# EAGLE design lights.v2 (EAGLE 5.11)
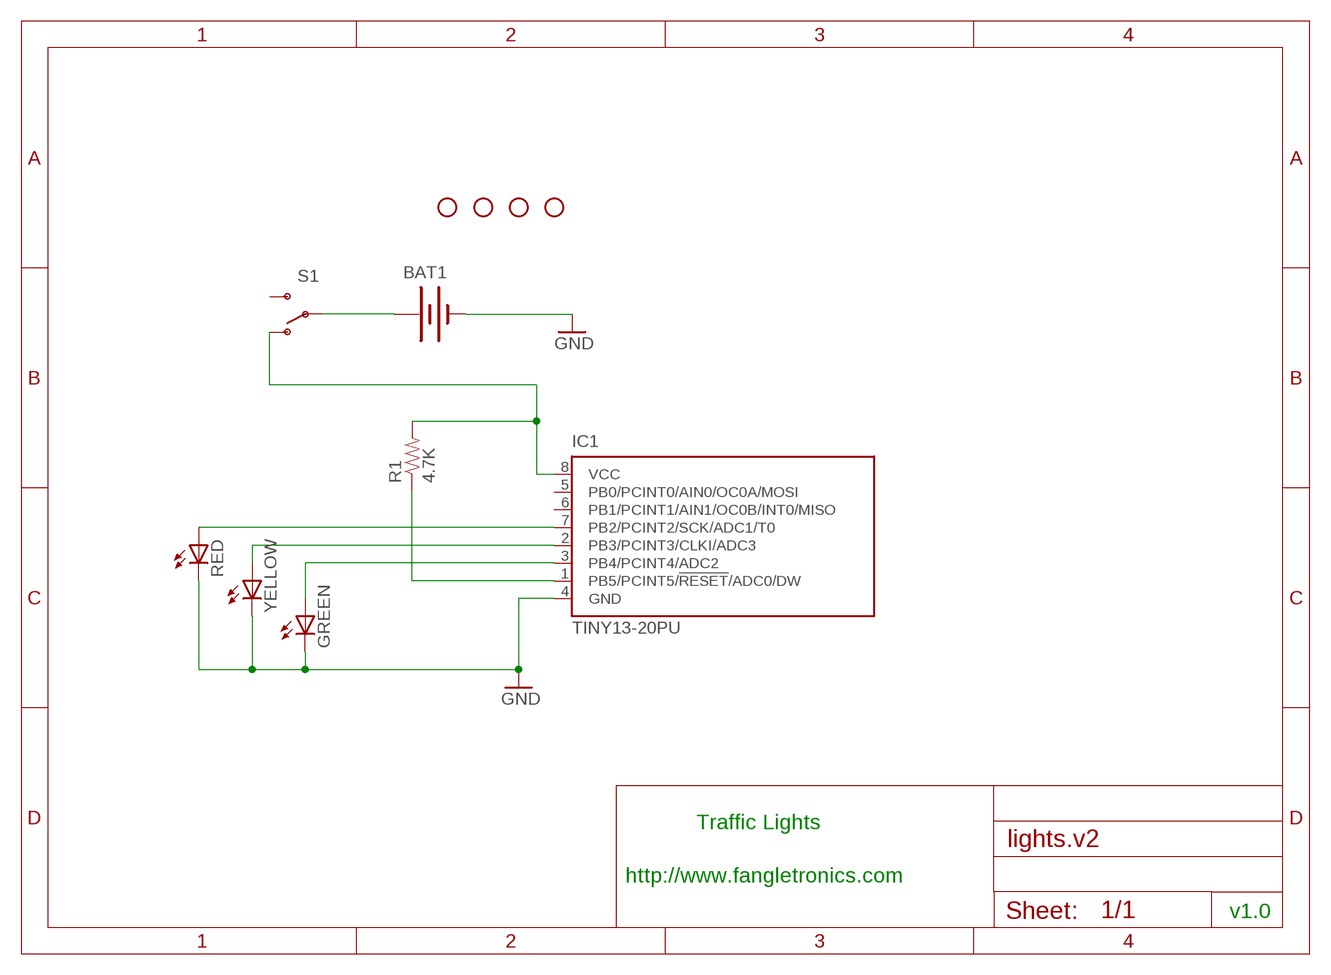
[diagram p0: schematic, sheet 1]

## Parts
BAT1  BATTERY20PTH  [BATTCOM_20MM_PTH]
GREEN  LED5MM  [LED5MM]
IC1  TINY13-20PU  [DIL08]
JP1  STAND-OFF  [STAND-OFF]
JP2  STAND-OFF  [STAND-OFF]
JP3  STAND-OFF  [STAND-OFF]
JP4  STAND-OFF  [STAND-OFF]
R1  4.7K  RESISTORPTH1  [AXIAL-0.3]
RED  LED5MM  [LED5MM]
S1  SWITCH-SPSTPTH  [SWITCH-SPDT]
YELLOW  LED5MM  [LED5MM]

## Nets
GND: BAT1.2(-) GREEN.K(C) IC1.4(GND) RED.K(C) YELLOW.K(C)
N$1: IC1.7(PB2/PCINT2/SCK/ADC1/T0) RED.A
N$2: IC1.2(PB3/PCINT3/CLKI/ADC3) YELLOW.A
N$3: GREEN.A IC1.3(PB4/PCINT4/ADC2)
N$4: IC1.1(PB5/PCINT5/!RESET!/ADC0/DW) R1.P$1
N$5: IC1.8(VCC) R1.P$2 S1.1(O)
N$6: BAT1.1(+) S1.2(P)
Unconnected: IC1.5(PB0/PCINT0/AIN0/OC0A/MOSI) IC1.6(PB1/PCINT1/AIN1/OC0B/INT0/MISO) S1.3(S)

## Notes on the sheet
- Traffic Lights
- http://www.fangletronics.com
- v1.0

## Library data of the parts
BAT1 = SparkFun:BATTERY: Battery Holders Various common sizes : AA, AAA, 20mm coin cell and 12mm coin cell.
GREEN RED YELLOW = SparkFun:LED: LEDs Standard schematic elements and footprints for 5mm, 3mm, 1206, and 0603 sized LEDs. 5mm - Spark Fun Electronics SKU : COM-00529 (and others)
IC1 = atmel:TINY13: 8-bit AVR Microcontroller with 1K Bytes In-System Programmable Flash Source: http://www.atmel.com/dyn/resources/prod_documents/2535S.pdf; MPN: ATTINY13-20PU; OC_FARNELL: 9171550; OC_NEWARK: 96K6521
JP1-JP4 = SparkFun:STAND-OFF: Stand Off This is the mechanical footprint for a #4 phillips button head screw. Use the keepout ring to avoid running the screw head into surrounding components. SKU : PRT-00447
R1 = Blank_Shield:RESISTOR: Resistor Basic schematic elements and footprints for 0603, 1206, and PTH 1/10th watt (small) resistors.
S1 = SparkFun:SWITCH-SPST: SPST Switch Simple slide switch. Spark Fun Electronics SKU : COM-00102

## Net classes
0 default: width 0.305 mm

## Board
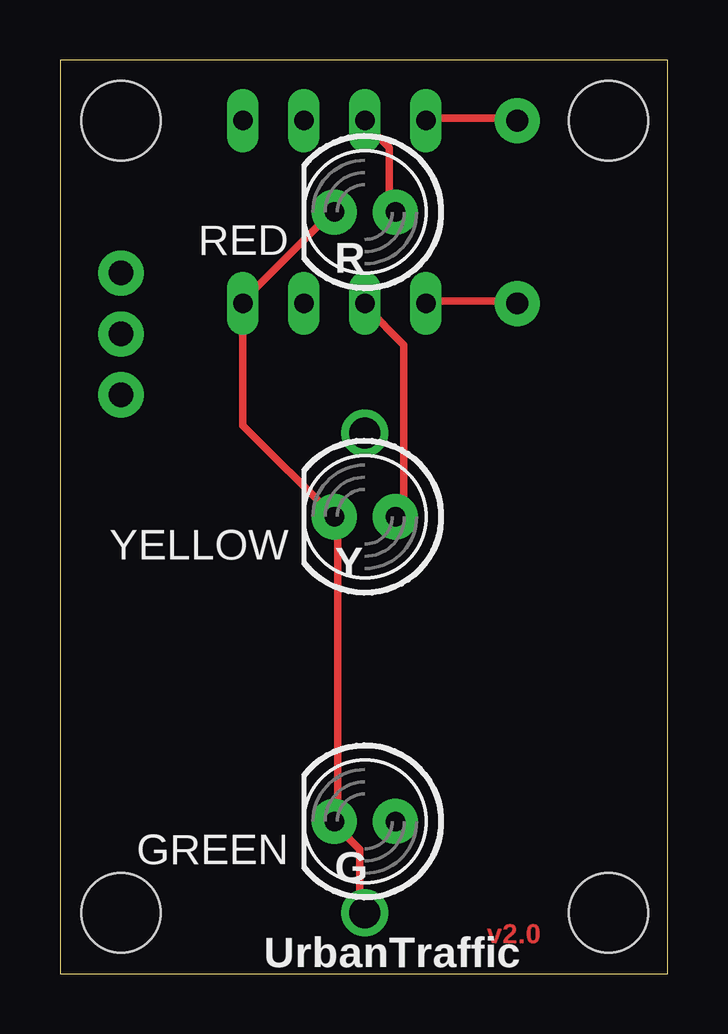
[diagram p1: board, top side]
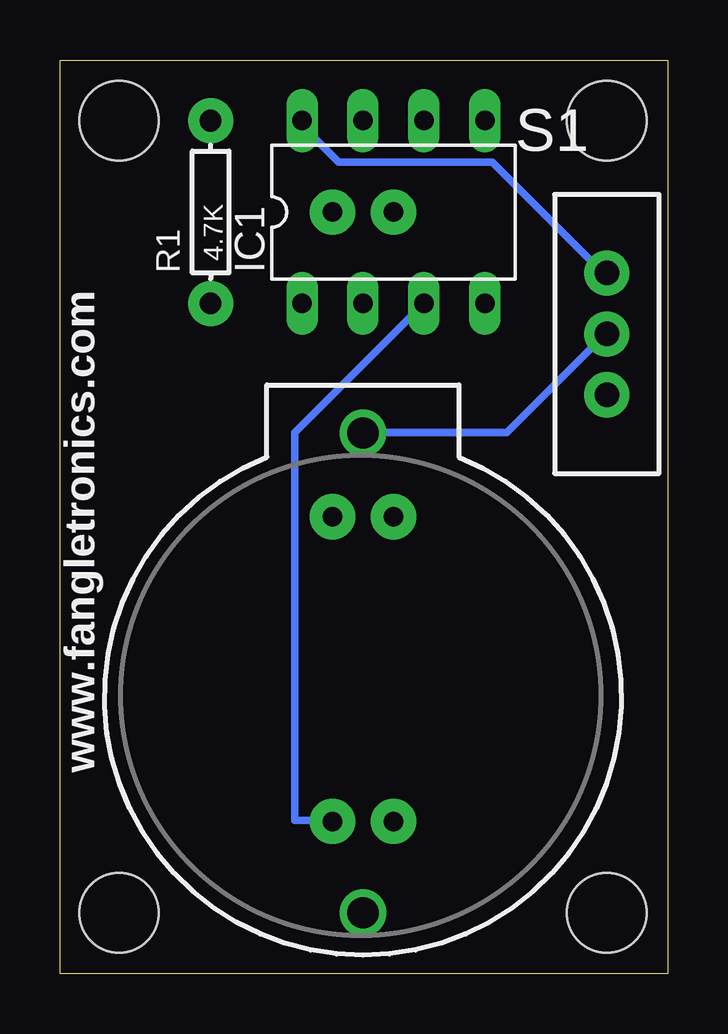
[diagram p2: board, bottom side, seen from below]

Size 25.32 x 38.09 mm. Coordinates in mm from the lower left corner, seen from the top.
Outline: 0,0 25.32,0 25.32,38.09 0,38.09 0,0
Copper layers (1*16): Top 0.035mm / dielectric 1.5mm / Bottom 0.035mm
Design rules "default": minimum track width 10mil, minimum drill 24mil, track to track 8mil, track to pad 8mil, pad to pad 8mil, via to via 8mil, smd to smd 8mil, copper to edge 40mil, drill to drill 8mil, minimum pad ring 10mil, minimum via ring 8mil, stop-mask expansion 4mil, vias tented up to drill 0mil, thermal gap 10mil

### Footprints (pad centres in the part's own frame; a part is rotated, then mirrored left to right if it is on the bottom)
BATTCOM_20MM_PTH = drill 1.3 round: 1 20,0; 2 0,0
LED5MM = drill 0.813 pad 1.88 round: A -1.27,0; K 1.27,0
DIL08 = drill 0.813 long: 1 -3.81,-3.81; 2 -1.27,-3.81; 3 1.27,-3.81; 4 3.81,-3.81; 5 3.81,3.81; 6 1.27,3.81; 7 -1.27,3.81; 8 -3.81,3.81
STAND-OFF = hole 3.302: 0,0
AXIAL-0.3 = drill 0.9 pad 1.88 round: P$1 -3.81,0; P$2 3.81,0
SWITCH-SPDT = drill 1.016 pad 1.88 round: 1 0,2.54; 2 0,0; 3 0,-2.54

### Placement (x,y rotation side)
BAT1  12.7,2.54 90 bottom
GREEN  12.7,6.35 180 top
IC1  11.43,31.75 0 bottom
JP1  22.86,2.54 0 top
JP2  2.54,2.54 0 top
JP3  2.54,35.56 0 top
JP4  22.86,35.56 0 top
R1  19.05,31.75 90 bottom
RED  12.7,31.75 180 top
S1  2.54,26.67 0 bottom
YELLOW  12.7,19.05 180 top

### Tracks (layer width: path | path; a pad name or v marks a point on that pad's centre or on a via)
GND
  Top 0.305: BAT1.2 12.5,2.74 12.5,5.18 11.58,6.1 GREEN.K 11.58,6.4 11.58,18.9 YELLOW.K 7.62,22.86 IC1.4 7.62,28.04 11.28,31.7 RED.K
N$1
  Top 0.305: IC1.7 12.8,35.36 13.72,34.44 13.72,32 RED.A
N$2
  Top 0.305: IC1.2 12.8,27.74 14.33,26.21 14.33,19.51 14.02,19.2 YELLOW.A
N$3
  Bottom 0.305: IC1.3 15.54,22.55 15.54,6.4 14.02,6.4 GREEN.A
N$4
  Top 0.305: IC1.1 15.24,28.04 18.9,28.04 R1.P$1
N$5
  Top 0.305: IC1.8 15.24,35.66 18.9,35.66 R1.P$2
  Bottom 0.305: S1.1 2.74,29.26 7.32,33.83 13.72,33.83 15.24,35.36 IC1.8
N$6
  Bottom 0.305: S1.2 2.74,26.52 6.71,22.55 12.5,22.55 BAT1.1

### Text on the board
Top: v2.0
tPlace: R | Y | G | UrbanTraffic
bPlace: www.fangletronics.com